# Altium project RGB_AUDIO_REACT.PrjPcb
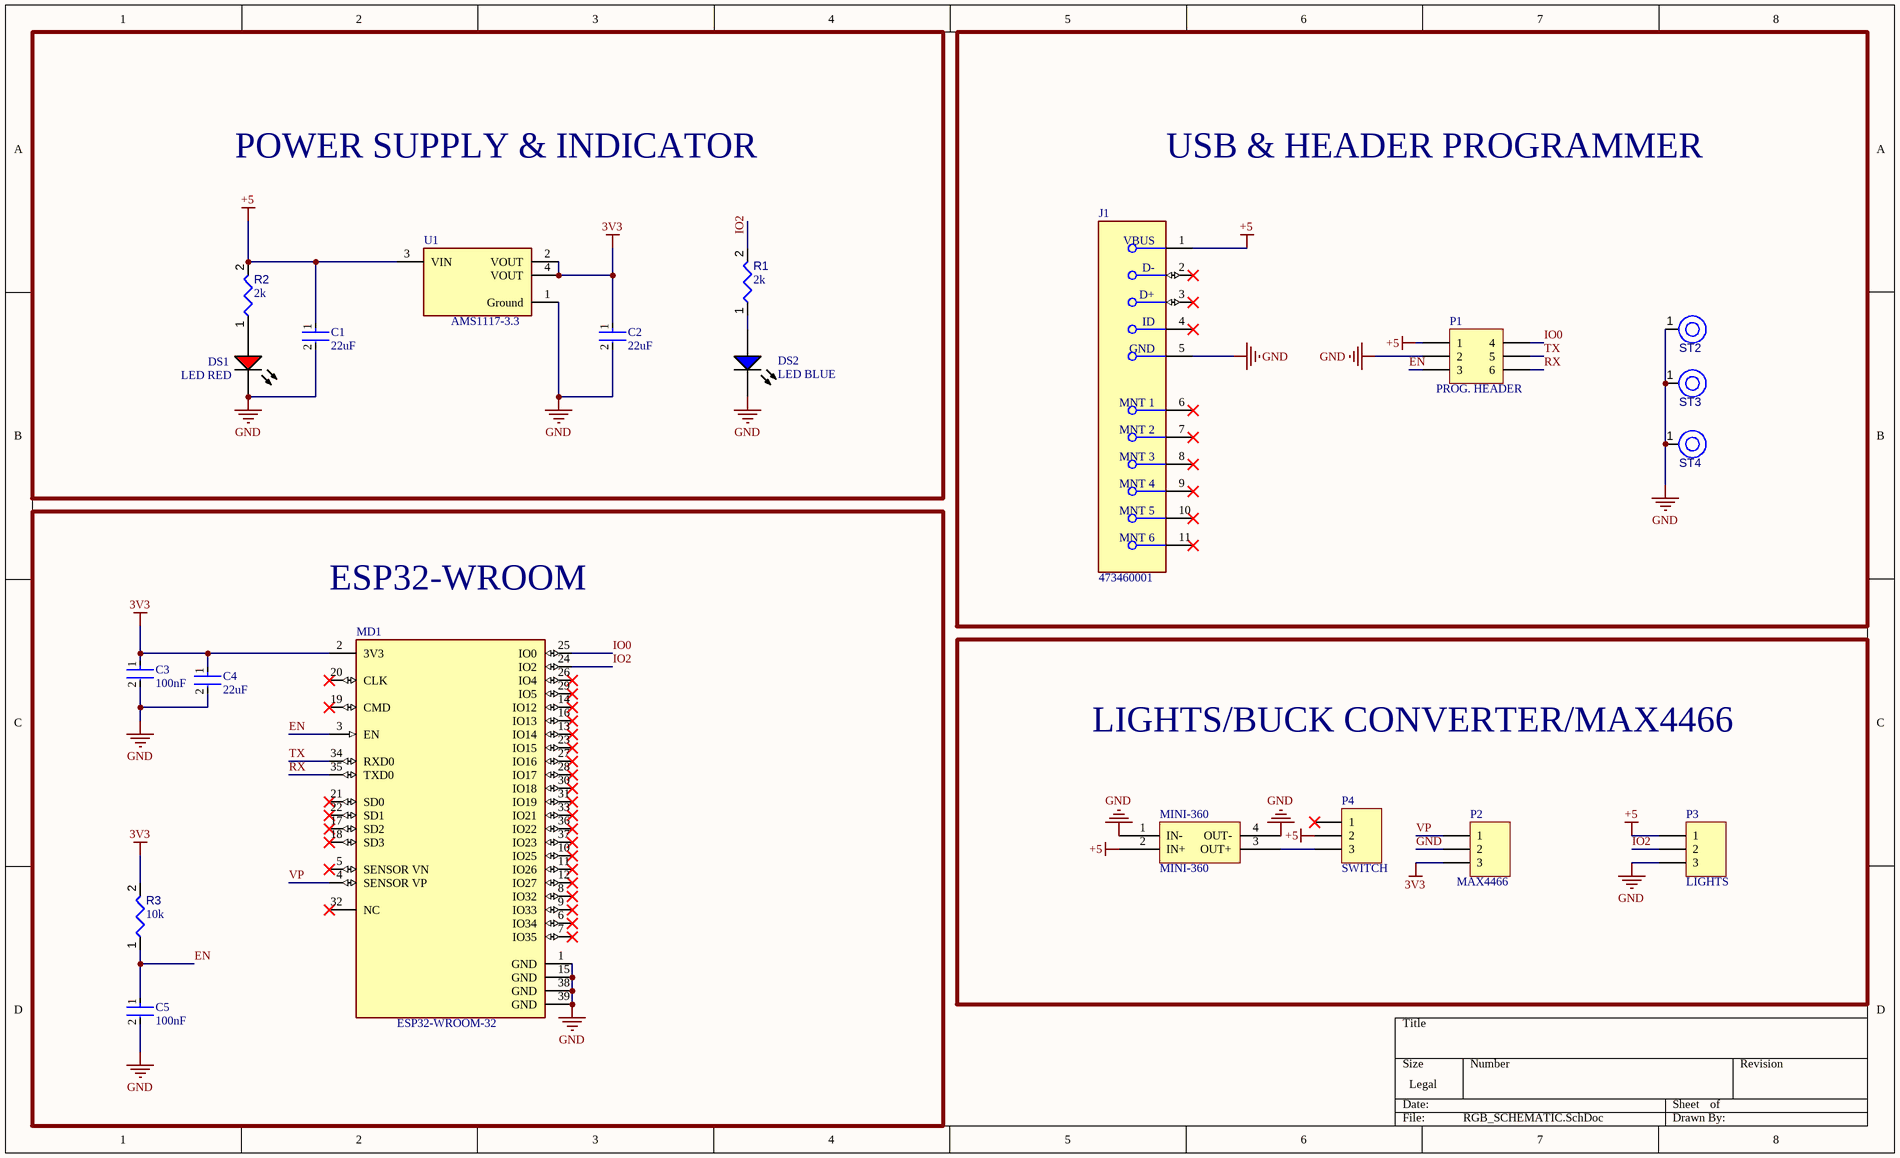
[diagram p0: RGB_SCHEMATIC.SchDoc]
1 sheet, 21 parts. Net scope: global (net labels, ports and power ports of the same name join across sheets).
Board file: RGB_PCB.PcbDoc

## Sheet RGB_SCHEMATIC.SchDoc: RGB_AUDIO_REACT
size Legal; Author: ANGELO ALIES; DrawnBy: ANGELO ALIES; SheetNumber: 1; SheetTotal: 1; SPICEModelCacheKWWVYWGS: <root> / <DocumentId>KWWVYWGS</DocumentId> / </root>

### Parts
C1  22uF  [FP-1206-L_3_2_0_2-W_1_6_0-IPC_C]
C2  22uF  [FP-1206-L_3_2_0_2-W_1_6_0-IPC_C]
C3  100nF  [FP-1206-L_3_2_0_2-W_1_6_0-MFG]
C4  22uF  [FP-1206-L_3_2_0_2-W_1_6_0-IPC_C]
C5  100nF  [FP-1206-L_3_2_0_2-W_1_6_0-MFG]
DS1  LED RED  [LTST-C191KRKT_V]
DS2  LED BLUE  [VISH-TLMX1100-2_V]
J1  473460001  [FP-473460001-MFG]
MD1  ESP32-WROOM-32  [FP-ESP32-WROOM-32-MFG]
MINI-360  MINI-360  [MINI-360]
P1  PROG. HEADER  [HDR2X3_CEN]
P2  MAX4466  [HDR1X3]
P3  LIGHTS  [HDR1X3]
P4  SWITCH  [HDR1X3]
R1  value 2k  [RESC0402(1005)_L]  (hidden comment: Resistor 2K +/-5 % 0402 63 mW)
R2  value 2k  [RESC0402(1005)_L]  (hidden comment: Resistor 2K +/-5 % 0402 63 mW)
R3  value 10k  [RESC1608X55X25ML10T15]  (hidden comment: Resistor 10k +/-1% 0603 100 mW)
ST2  PTH-M2D5X5  [PTH-M2D5X5]  (value not drawn)
ST3  PTH-M2D5X5  [PTH-M2D5X5]  (value not drawn)
ST4  PTH-M2D5X5  [PTH-M2D5X5]  (value not drawn)
U1  AMS1117-3.3  [FP-AMS1117-IPC_C]

### Blocks framed on the sheet
POWER SUPPLY & INDICATOR: C1 C2 DS1 DS2 R1 R2 U1
USB & HEADER PROGRAMMER: J1 P1 ST2-ST4
ESP32-WROOM: C3-C5 MD1 R3
LIGHTS/BUCK CONVERTER/MAX4466: MINI-360 P2-P4

### Nets
3V3: C2.1 C3.1 C4.1 MD1.2(3V3) P2.3 R3.2 U1.2(VOUT) U1.4(VOUT)
+5: C1.1 J1.1(VBUS) MINI-360.2(IN+) P1.1 P3.1 P4.2 R2.2 U1.3(VIN)
GND: C1.2 C2.2 C3.2 C4.2 C5.2 DS1.2(K) DS2.2(K) J1.5(GND) MD1.1(GND) MD1.15(GND) MD1.38(GND) MD1.39(GND) MINI-360.1(IN-) MINI-360.4(OUT-) P1.2 P2.2 P3.3 ST2.1(H1) ST3.1(H1) ST4.1(H1) U1.1(Ground)
EN: C5.1 MD1.3(EN) P1.3 R3.1
IO0: MD1.25(IO0) P1.4
IO2: MD1.24(IO2) P3.2 R1.2
RX: MD1.35(TXD0) P1.6
TX: MD1.34(RXD0) P1.5
VP: MD1.4(SENSOR_VP) P2.1
NetDS1_1: DS1.1(A) R2.1
NetDS2_1: DS2.1(A) R1.1
NetMINI-360_3: MINI-360.3(OUT+) P4.3

Not connected (* = marked no-connect by the designer): J1 2(D-)* 3(D+)* 4(ID)* 6(MNT_1)* 7(MNT_2)* 8(MNT_3)* 9(MNT_4)* 10(MNT_5)* 11(MNT_6)*; MD1 5(SENSOR_VN)* 6(IO34)* 7(IO35)* 8(IO32)* 9(IO33)* 10(IO25)* 11(IO26)* 12(IO27)* 13(IO14)* 14(IO12)* 16(IO13)* 17(SD2)* 18(SD3)* 19(CMD)* 20(CLK)* 21(SD0)* 22(SD1)* 23(IO15)* 26(IO4)* 27(IO16)* 28(IO17)* 29(IO5)* 30(IO18)* 31(IO19)* 32(NC)* 33(IO21)* 36(IO22)* 37(IO23)*; P4 1*

### Library data of the parts
C1 C2 C4 = CMP-1037-04992-2: General Purpose Ceramic Capacitor, 1206, 22uF, 10%, X5R, 15%, 16V; REACH SVHC: No SVHC; Height: 0.07mm; Lead Free: Lead Free; Voltage Rating: 16V; Width: 0.063inch; Voltage Rating (DC): 16V; Mount: Surface Mount; Capacitance: 22uF; Case Code (Imperial): 1206; Package Quantity: 1; Radiation Hardening: No; Packaging: Tape and Reel; Number of Pins: 2; Construction: Flat; Max Operating Temperature: 85°C; Depth: 1.6mm; Case Code (Metric): 3216; Thickness: 0.07inch; Min Operating Temperature: -55°C; Contact Plating: Tin; Dielectric: X5R; Case/Package: 1206; Series: -; Termination: SMD/SMT; Length: 3.2mm; RoHS Compliant: Yes; Tolerance: 10%
C3 C5 = CMP-2000-05018-2: General Purpose Ceramic Capacitor, 1206, 100nF, 10%, X7R, 15%, 50V; Dissipation Factor: 2.5%; Insulation Resistance: 100GR; Dielectric: X7R; Thickness: 0.037inch; Case Code (Imperial): 1206; Case Code (Metric): 3216; Dielectric Material: Ceramic; Width: 1.6mm; Voltage Rating (DC): 50V; Termination: SMD/SMT; Tolerance: 10%; REACH SVHC: No SVHC; Height: 0.94mm; Length: 3.2mm; Voltage: 50V; Capacitance: 100nF; Packaging: Tape and Reel; Depth: 1.6mm; Voltage Rating: 50V; Series: -; Contact Plating: Tin; Mount: Surface Mount; Package Quantity: 1; Construction: Flat; Max Operating Temperature: 125°C; Min Operating Temperature: -55°C; Case/Package: 1206; Lead Free: Lead Free; RoHS Compliant: Yes; Number of Pins: 2; Radiation Hardening: No
DS1 = CMP-007-00024-2: LED Uni-Color Red, 62.5 mW, 25 mA, -30 to 85 degC, 2-Pin SMD, RoHS, Tape and Reel; Manufacturer: Lite-On; Power: 75mW; Forward Voltage: 2V; Luminous Intensity: 54mcd; Lens Style: Diffused; Viewing Angle: 130degrees; Forward Current: 20mA; Manufacturer URL: http://www.us.liteon.com/; Case/Package: 0603; Datasheet Version: Rev. F, 05/2013; Package Reference: C191KRKT; Datasheet URL: http://optoelectronics.liteon.com/upload/download/DS-22-99-0151/S_110_LTST-C190KRKT.pdf; Package Description: 2-Pin Surface Mount Device, Body 1.6 x 0.8 mm; Nominal Vf: 2V; Packaging: TapeandReel; RoHS Compliant: True; Pins: 2; Illumination Colour: Red; Colour: Red; Mounting Technology: SM; Package Quantity: 3000; Min Operating Temperature: -55°C; Max Operating Temperature: 85°C
DS2 = CMP-007-00028-2: Blue LED, 10 mA, 3.9 V, -40 to 100 degC, 2-Pin SMD (0603), RoHS, Tape and Reel; Manufacturer: Vishay Semiconductor; Forward Voltage: 3.9V; Viewing Angle: 160degrees; Power: 68mW; Forward Current: 10mA; Lens Style: Diffused; Luminous Intensity: 5mcd; Case/Package: 0603; Datasheet URL: http://download.siliconexpert.com/pdfs/2016/8/7/12/43/26/667/vsh_/manual/379263299541529tlmb1100.pdf; Illumination Colour: Blue; Datasheet Version: Rev. 2.7, 03/2016; Manufacturer URL: http://www.vishay.com/; Package Reference: 0603; Min Operating Temperature: -40°C; Packaging: TapeandReel; RoHS Compliant: True; Nominal Vf: 3.9V; Mounting Technology: SM; Pins: 2; Package Description: 2-Pin Surface Mount Device, Body 1.6 x 0.8 mm; Colour: Blue; Package Quantity: 3000; Max Operating Temperature: 100°C
J1 = CMP-2000-05246-2: CONN RCPT USB2.0 MICRO B SMD R/A; Manufacturer: Molex; Conn Orientation: Right Angle; Is Female: yes; Shielding: true; Pitch: 0.65mm; Number Of Contacts: 5; Voltage Rating: 30V; Current Rating: 1.8A; Device Class L2: USB Connectors; Digikey Description: CONN RCPT USB2.0 MICRO B SMD R/A; Height: 2.945mm; RoHS: TRUE; ComponentLink2Description: Datasheet; Octopart: https://octopart.com/47346-0001-molex-7164928; Automotive: No; Package: 0; Category: Conn; Device Class L1: Connectors; Usb Standard: USB 2.0; Temperature: -30°C to +85°C; Temperature Range Low: -30°C; Footprint Url: https://www.molex.com/pdm_docs/sd/473460001_sd.pdf; ComponentLink2URL: https://www.molex.com/webdocs/datasheets/pdf/en-us/0473460001_IO_CONNECTORS.pdf; Lead Free: Yes; Manufacturer Part Number: 473460001; Contact Material: Gold,Nickel; Temperature Range High: +85°C; Device Class L3: unset
MD1 = CMP-194065-000008-1: RX TXRX MOD WIFI SURFACE MOUNT; Frequency: 2.5GHz; Sensitivity: -98dBm; Operating Supply Voltage: 3.6V; Data Rate: 150Mbps; Weight: 0.088185oz; Package Quantity: 550; Min Operating Temperature: -40°C; Mount: Surface Mount; Max Operating Temperature: 85°C; Packaging: Cut Tape; Case/Package: SMD/SMT
MINI-360 = CMP-004-000006-1: Design Item ID: MINI-360; Source: MINI-360.SchLib
P1 = Header 3X2A: Header, 3-Pin, Dual row; LatestRevisionDate: 17-Jul-2002; LatestRevisionNote: Re-released for DXP Platform.; Publisher: Altium Limited
P2-P4 = Header 3: Header, 3-Pin; LatestRevisionDate: 17-Jul-2002; LatestRevisionNote: Re-released for DXP Platform.; Publisher: Altium Limited
R1 R2 = CMP-009-00138-3: Chip Resistor, 2 kOhms, +/-5 %, 63 mW, -55 to 155 degC, 0402; Tolerance: 5%; Power: 63mW; Max Operating Temperature: 155°C; Pins: 2; Min Operating Temperature: -55°C; Case/Package: 0402
R3 = CMP-009-00017-5: Chip Resistor, 10 KOhm, +/- 1%, 01 W, -55 to 155 degC, 0603 (1608 Metric); Voltage Rating: 50V; Power: 100mW; RoHS Compliant: True; Min Operating Temperature: -55°C; Pins: 2; Case/Package: 0603; Mounting Technology: SM; Max Operating Temperature: 155°C; Tolerance: 1%
ST2-ST4 = CMP-00028-00004-2: M2 PTH (2.5mm), 5mm pad; Pins: 1
U1 = CMP-209535-000001-1: LDO Voltage Regulators 1A, 3.3V; Manufacturer: Advanced Monolithic Systems; Dropout Voltage: 1.1V; Output Type: Fixed; Nominal Supply Current: 5mA; Max Power Dissipation: 1.2W; Max Supply Voltage: 15V; Number Of Outputs: 1; Standoff Height: 0.64mm; Max Junction Temp: +125°C; Height: 1.8mm; Package: AMS1117; Device Class L2: Power Management ICs; ComponentLink2Description: Datasheet; ComponentLink2URL: http://www.advanced-monolithic.com/pdf/ds1117.pdf; Category: IC; RoHS: TRUE; Automotive: No; Device Class L1: Integrated Circuits (ICs); Output Current: 1A; Device Class L3: Voltage Regulators - Linear; Temperature: -40°C to +125°C; Output Voltage: 3.3V; Manufacturer Part Number: AMS1117-3.3; Temperature Range Low: -40°C; Octopart: https://octopart.com/ams1117-3.3-advanced+monolithic+systems-25899300; Lead Free: Yes; Ipc Land Pattern Name: SOT229P700X180-4; Temperature Range High: +125°C